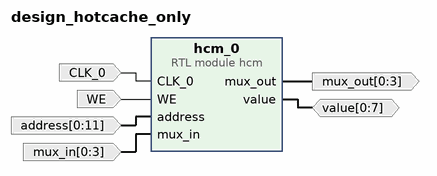
[diagram p0: block diagram of the top level]
# Vivado block design design_hotcache_only, xc7a100tcsg324-1, Vivado 2018.3
create_bd_design design_hotcache_only

create_bd_port -dir I -type clk CLK_0
create_bd_port -dir I WE
create_bd_port -dir I -from 0 -to 11 address
create_bd_port -dir I -from 0 -to 3 mux_in
create_bd_port -dir IO -from 0 -to 7 value
create_bd_port -dir O -from 0 -to 3 mux_out

create_bd_cell -type module -reference hcm hcm_0

# ---- connections ----

connect_bd_net -net CLK_0_1 [get_bd_ports CLK_0] [get_bd_pins hcm_0/CLK_0]
connect_bd_net [get_bd_ports WE] [get_bd_pins hcm_0/WE]
connect_bd_net [get_bd_ports address] [get_bd_pins hcm_0/address]
connect_bd_net [get_bd_ports mux_in] [get_bd_pins hcm_0/mux_in]
connect_bd_net [get_bd_ports value] [get_bd_pins hcm_0/value]
connect_bd_net [get_bd_pins hcm_0/mux_out] [get_bd_ports mux_out]

validate_bd_design
save_bd_design
